# EAGLE board goJAMMAv02 (EAGLE 9.3.1), part 1 of 2
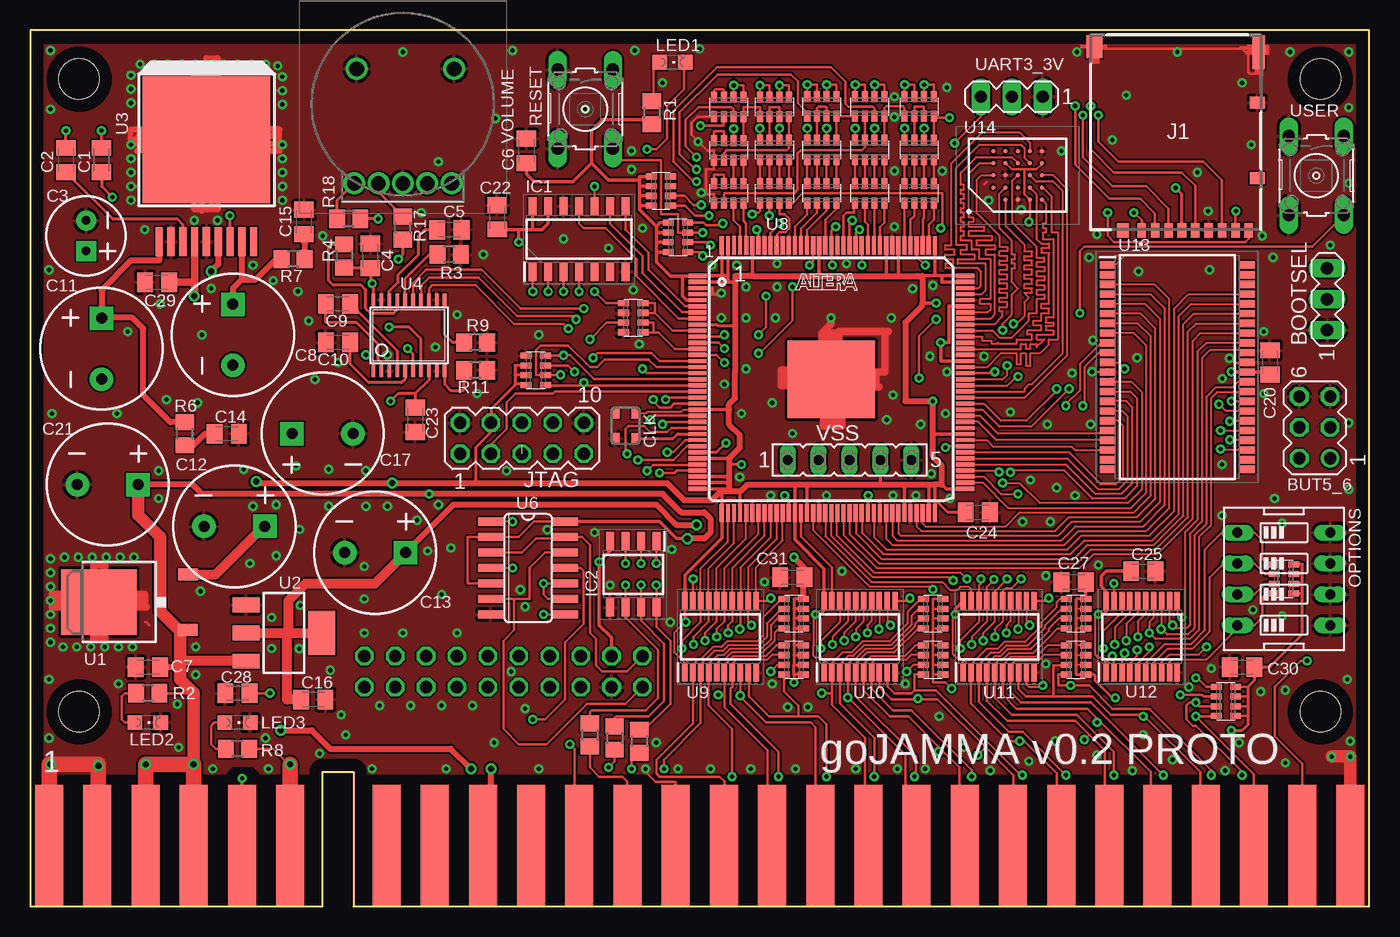
[diagram p2: board, top side]
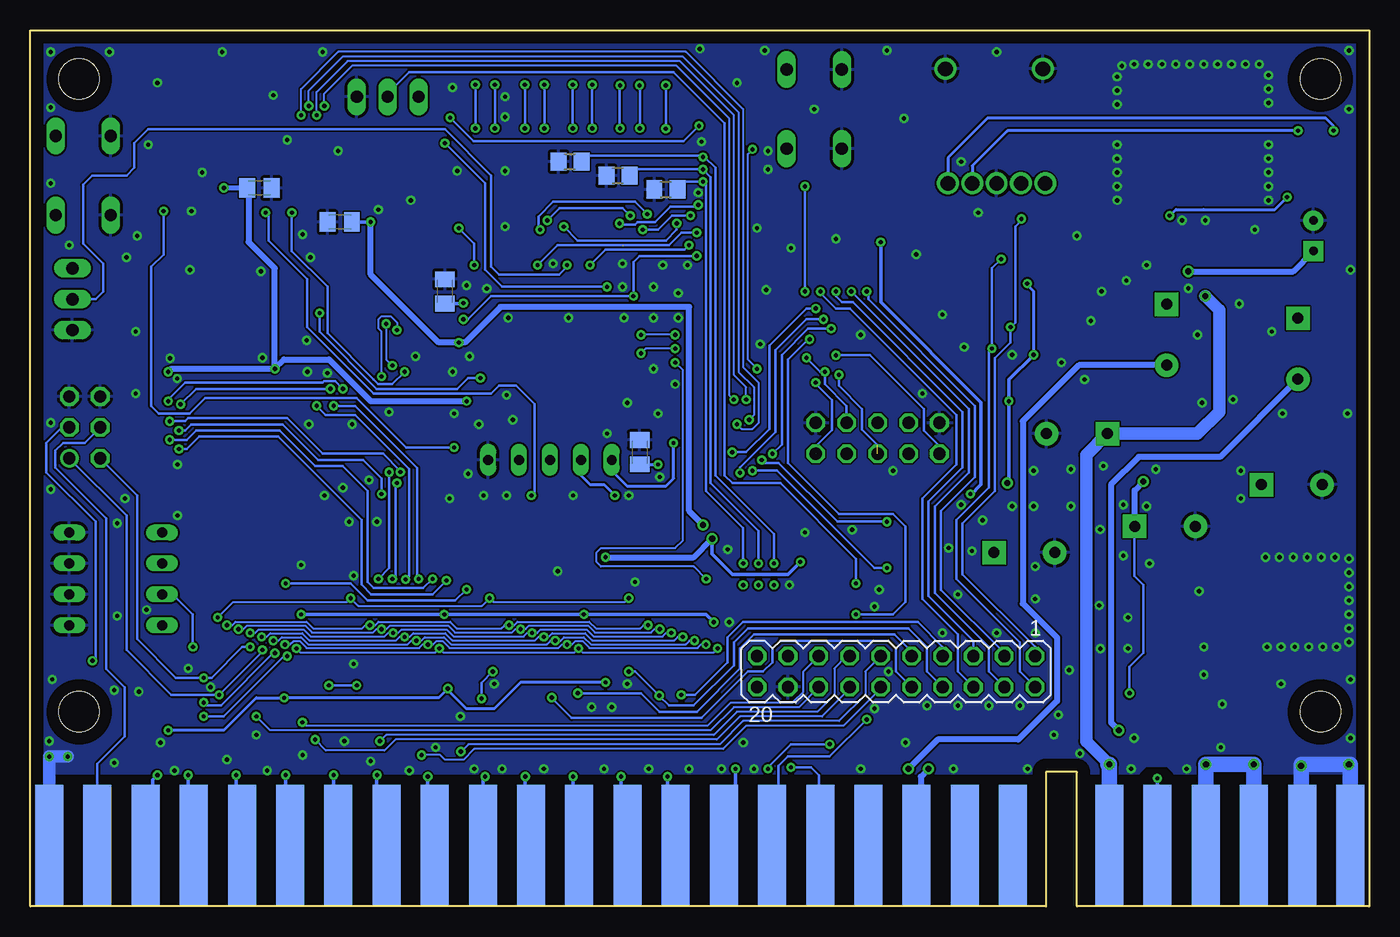
[diagram p3: board, bottom side, seen from below]

Size 110 x 72 mm. Coordinates in mm from the lower left corner, seen from the top.
Outline: 0,0 24,0 24,11.05 26.54,11.05 26.54,0 110,0 110,72 0,72 0,0
Copper layers (1*16): Top 0.035mm / dielectric 1.5mm / Bottom 0.035mm
Design rules "default *": minimum track width 6mil, minimum drill 0.35mm, track to track 6mil, track to pad 6mil, pad to pad 6mil, via to via 6mil, smd to smd 6mil, copper to edge 40mil, drill to drill 6mil, minimum pad ring 10mil, minimum via ring 8mil, stop-mask expansion 4mil, vias tented up to drill 20mil, thermal gap 10mil

## Footprints (pad centres in the part's own frame; a part is rotated, then mirrored left to right if it is on the bottom)
MA03-1 = drill 1.016 long: 1 -2.54,0; 2 0,0; 3 2.54,0
MA03-2 = drill 1.016: 1 -2.54,-1.27 | drill 1.016 octagon: 2 -2.54,1.27; 3 0,-1.27; 4 0,1.27; 5 2.54,-1.27; 6 2.54,1.27
C0805K = smd 1.3 x 1.6: 1 -1,0; 2 1,0
CPOL-RADIAL-2.5MM-6.5MM = drill 0.7 pad 1.651 square: 1 1.25,0 | drill 0.7 pad 1.651: 2 -1.25,0
CPOL-RADIAL-5MM-10MM = drill 0.9 pad 1.93 square: + 2.5,0 | drill 0.9 pad 1.93: - -2.5,0
ASE = smd 0.9 x 0.65: 1 -1.05,-0.825; 2 1.05,-0.825; 3 1.05,0.825; 4 -1.05,0.825
STAND-OFF = hole 3.302: 0,0
SOIC127P600X175-14N = smd 1.5 x 0.65: 1 -2.7,3.81; 2 -2.7,2.54; 3 -2.7,1.27; 4 -2.7,0; 5 -2.7,-1.27; 6 -2.7,-2.54; 7 -2.7,-3.81; 8 2.7,-3.81; 9 2.7,-2.54; 10 2.7,-1.27; 11 2.7,0; 12 2.7,1.27; 13 2.7,2.54; 14 2.7,3.81
SOIC127P600X175-8N = smd 1.525 x 0.65: 1 -2.712,1.905; 2 -2.712,0.635; 3 -2.712,-0.635; 4 -2.712,-1.905; 5 2.712,-1.905; 6 2.712,-0.635; 7 2.712,0.635; 8 2.712,1.905
DM3AT-SF-PEJM5_1 = smd 0.7 x 1.2: 1 -4.191,0.057; 2 -5.291,0.057; 3 -6.391,0.057; 4 -7.491,0.057; 5 -8.591,0.057; 6 -9.691,0.057; 7 -10.791,0.057; 8 -11.891,0.057; 10 -12.991,0.057 | smd 1.2 x 1: 9 -13.691,-10.443; 12 -13.691,-4.243 | smd 1 x 1.2: 11 -2.641,0.057 | smd 1 x 2.8: 13 -13.791,-14.593 | smd 1.3 x 1.9: 14 -0.291,-15.043
JAMMA_TOP = smd 2.3 x 10: 1 -53.46,0; 2 -49.5,0; 3 -45.54,0; 4 -41.58,0; 5 -37.62,0; 6 -33.66,0; 8 -25.74,0; 9 -21.78,0; 10 -17.82,0; 11 -13.86,0; 12 -9.9,0; 13 -5.94,0; 14 -1.98,0; 15 1.98,0; 16 5.94,0; 17 9.9,0; 18 13.86,0; 19 17.82,0; 20 21.78,0; 21 25.74,0; 22 29.7,0; 23 33.66,0; 24 37.62,0; 25 41.58,0; 26 45.54,0; 27 49.5,0; 28 53.46,0
JAMMA_BOTTOM = smd 2.3 x 10 bottom: _A 33.66,0; _B 37.62,0; _C 41.58,0; _D 45.54,0; _E 49.5,0; _F 53.46,0; A -53.46,0; B -49.5,0; C -45.54,0; D -41.58,0; E -37.62,0; F -33.66,0; J -25.74,0; K -21.78,0; L -17.82,0; M -13.86,0; N -9.9,0; P -5.94,0; R -1.98,0; S 1.98,0; T 5.94,0; U 9.9,0; V 13.86,0; W 17.82,0; X 21.78,0; Y 25.74,0; Z 29.7,0
MA05-2 = drill 1.016 octagon: 1 -5.08,-1.27; 2 -5.08,1.27; 3 -2.54,-1.27; 4 -2.54,1.27; 5 0,-1.27; 6 0,1.27; 7 2.54,-1.27; 8 2.54,1.27; 9 5.08,-1.27; 10 5.08,1.27
CHIPLED_0805 = smd 1.2 x 1.2: A 0,-1.05; C 0,1.05
EDG-04 = drill 0.813 long: 1 -3.81,-3.81; 2 -1.27,-3.81; 3 1.27,-3.81; 4 3.81,-3.81; 5 3.81,3.81; 6 1.27,3.81; 7 -1.27,3.81; 8 -3.81,3.81
R0805 = smd 1.3 x 1.5: 1 -0.95,0; 2 0.95,0
B3F-10XX = drill 1.016 long: 1 -3.251,2.261; 2 3.251,2.261; 3 -3.251,-2.261; 4 3.251,-2.261
CTS742C083 = smd 0.5 x 0.9: 1 -1.2,-0.8; 2 -0.4,-0.8; 3 0.4,-0.8; 4 1.2,-0.8; 5 1.2,0.8; 6 0.4,0.8; 7 -0.4,0.8; 8 -1.2,0.8
MA10-2 = drill 1.016 octagon: 1 -11.43,-1.27; 2 -11.43,1.27; 3 -8.89,-1.27; 4 -8.89,1.27; 5 -6.35,-1.27; 6 -6.35,1.27; 7 -3.81,-1.27; 8 -3.81,1.27; 9 -1.27,-1.27; 10 -1.27,1.27; 11 1.27,-1.27; 12 1.27,1.27; 13 3.81,-1.27; 14 3.81,1.27; 15 6.35,-1.27; 16 6.35,1.27; 17 8.89,-1.27; 18 8.89,1.27; 19 11.43,-1.27; 20 11.43,1.27
FE05-1 = drill 0.813 long: 1 -5.08,0; 2 -2.54,0; 3 0,0; 4 2.54,0; 5 5.08,0
TO-252 = smd 1 x 1.6: 1 -2.28,-4.8; 2 2.28,-4.8 | smd 5.4 x 6.2: 3 0,2.5
SOT223 = smd 1.219 x 2.235: 1 -2.311,-3.099; 2 0,-3.099; 3 2.311,-3.099 | smd 3.6 x 2.2: 4 0,3.099
DDPAK-9 = smd 0.6 x 2.4: 1 -3.89,0.03; 2 -2.92,0.03; 3 -1.95,0.03; 4 -0.98,0.03; 5 -0.01,0.03; 6 0.96,0.03; 7 1.93,0.03; 8 2.9,0.03; 9 3.87,0.03 | smd 10.48 x 10.42: 10 0,8.4
TSSOP20 = smd 0.305 x 0.991: 1 -2.925,-2.918; 2 -2.275,-2.918; 3 -1.625,-2.918; 4 -0.975,-2.918; 5 -0.325,-2.918; 6 0.325,-2.918; 7 0.975,-2.918; 8 1.625,-2.918; 9 2.275,-2.918; 10 2.925,-2.918; 11 2.925,2.918; 12 2.275,2.918; 13 1.625,2.918; 14 0.975,2.918; 15 0.325,2.918; 16 -0.325,2.918; 17 -0.975,2.918; 18 -1.625,2.918; 19 -2.275,2.918; 20 -2.925,2.918
SO14 = smd 0.66 x 2.032: 1 -3.81,-3.073; 2 -2.54,-3.073; 3 -1.27,-3.073; 4 0,-3.073; 5 1.27,-3.073; 6 2.54,-3.073; 7 3.81,-3.073; 8 3.81,3.073; 9 2.54,3.073; 10 1.27,3.073; 11 0,3.073; 12 -1.27,3.073; 13 -2.54,3.073; 14 -3.81,3.073
ALTERA_EQFP144 = smd 1.5 x 0.35: 1 -11,8.5; 2 -11,8; 3 -11,7.5; 4 -11,7; 5 -11,6.5; 6 -11,6; 7 -11,5.5; 8 -11,5; 9 -11,4.5; 10 -11,4; 11 -11,3.5; 12 -11,3; 13 -11,2.5; 14 -11,2; 15 -11,1.5; 16 -11,1; 17 -11,0.5; 18 -11,0; 19 -11,-0.5; 20 -11,-1; 21 -11,-1.5; 22 -11,-2; 23 -11,-2.5; 24 -11,-3; 25 -11,-3.5; 26 -11,-4; 27 -11,-4.5; 28 -11,-5; 29 -11,-5.5; 30 -11,-6; 31 -11,-6.5; 32 -11,-7; 33 -11,-7.5; 34 -11,-8; 35 -11,-8.5; 36 -11,-9; 73 11,-9; 74 11,-8.5; 75 11,-8; 76 11,-7.5; 77 11,-7; 78 11,-6.5; 79 11,-6; 80 11,-5.5; 81 11,-5; 82 11,-4.5; 83 11,-4; 84 11,-3.5; 85 11,-3; 86 11,-2.5; 87 11,-2; 88 11,-1.5; 89 11,-1; 90 11,-0.5; 91 11,0; 92 11,0.5; 93 11,1; 94 11,1.5; 95 11,2; 96 11,2.5; 97 11,3; 98 11,3.5; 99 11,4; 100 11,4.5; 101 11,5; 102 11,5.5; 103 11,6; 104 11,6.5; 105 11,7; 106 11,7.5; 107 11,8; 108 11,8.5 | smd 0.35 x 1.5: 37 -9,-11; 38 -8.5,-11; 39 -8,-11; 40 -7.5,-11; 41 -7,-11; 42 -6.5,-11; 43 -6,-11; 44 -5.5,-11; 45 -5,-11; 46 -4.5,-11; 47 -4,-11; 48 -3.5,-11; 49 -3,-11; 50 -2.5,-11; 51 -2,-11; 52 -1.5,-11; 53 -1,-11; 54 -0.5,-11; 55 0,-11; 56 0.5,-11; 57 1,-11; 58 1.5,-11; 59 2,-11; 60 2.5,-11; 61 3,-11; 62 3.5,-11; 63 4,-11; 64 4.5,-11; 65 5,-11; 66 5.5,-11; 67 6,-11; 68 6.5,-11; 69 7,-11; 70 7.5,-11; 71 8,-11; 72 8.5,-11; 109 8.5,11; 110 8,11; 111 7.5,11; 112 7,11; 113 6.5,11; 114 6,11; 115 5.5,11; 116 5,11; 117 4.5,11; 118 4,11; 119 3.5,11; 120 3,11; 121 2.5,11; 122 2,11; 123 1.5,11; 124 1,11; 125 0.5,11; 126 0,11; 127 -0.5,11; 128 -1,11; 129 -1.5,11; 130 -2,11; 131 -2.5,11; 132 -3,11; 133 -3.5,11; 134 -4,11; 135 -4.5,11; 136 -5,11; 137 -5.5,11; 138 -6,11; 139 -6.5,11; 140 -7,11; 141 -7.5,11; 142 -8,11; 143 -8.5,11; 144 -9,11 | smd 7.2 x 6.35: GND 0,0
SOP65P640X120-20N = smd 1.475 x 0.45: 1 -2.938,2.925; 2 -2.938,2.275; 3 -2.938,1.625; 4 -2.938,0.975; 5 -2.938,0.325; 6 -2.938,-0.325; 7 -2.938,-0.975; 8 -2.938,-1.625; 9 -2.938,-2.275; 10 -2.938,-2.925; 11 2.938,-2.925; 12 2.938,-2.275; 13 2.938,-1.625; 14 2.938,-0.975; 15 2.938,-0.325; 16 2.938,0.325; 17 2.938,0.975; 18 2.938,1.625; 19 2.938,2.275; 20 2.938,2.925
SOP80P1176X120-44N = smd 1.295 x 0.6: 1 -5.728,8.4; 2 -5.728,7.6; 3 -5.728,6.8; 4 -5.728,6; 5 -5.728,5.2; 6 -5.728,4.4; 7 -5.728,3.6; 8 -5.728,2.8; 9 -5.728,2; 10 -5.728,1.2; 11 -5.728,0.4; 12 -5.728,-0.4; 13 -5.728,-1.2; 14 -5.728,-2; 15 -5.728,-2.8; 16 -5.728,-3.6; 17 -5.728,-4.4; 18 -5.728,-5.2; 19 -5.728,-6; 20 -5.728,-6.8; 21 -5.728,-7.6; 22 -5.728,-8.4; 23 5.728,-8.4; 24 5.728,-7.6; 25 5.728,-6.8; 26 5.728,-6; 27 5.728,-5.2; 28 5.728,-4.4; 29 5.728,-3.6; 30 5.728,-2.8; 31 5.728,-2; 32 5.728,-1.2; 33 5.728,-0.4; 34 5.728,0.4; 35 5.728,1.2; 36 5.728,2; 37 5.728,2.8; 38 5.728,3.6; 39 5.728,4.4; 40 5.728,5.2; 41 5.728,6; 42 5.728,6.8; 43 5.728,7.6; 44 5.728,8.4
BGA24C100P5X5_600X800X120 = smd 0.37 x 0.37: A2 -1,2; A3 0,2; A4 1,2; A5 2,2; B1 -2,1; B2 -1,1; B3 0,1; B4 1,1; B5 2,1; C1 -2,0; C2 -1,0; C3 0,0; C4 1,0; C5 2,0; D1 -2,-1; D2 -1,-1; D3 0,-1; D4 1,-1; D5 2,-1; E1 -2,-2; E2 -1,-2; E3 0,-2; E4 1,-2; E5 2,-2
RK14J12A0A0K = drill 1.2 pad 1.8: 1 0,0; 2 2,0; 3 -2,0; 4 4,0; 5 -4,0 | drill 1.204 pad 1.806: MH1 -3.8,9.4; MH2 4.2,9.4

## Placement (x,y rotation side)
BOOTSEL  [MA03-1]  106.55,49.91 90 top
BUT5_6  [MA03-2]  105.54,39.37 90 top
C1  100nF  [C0805K]  5.84,61.34 270 top
C2  100nF  [C0805K]  2.92,61.34 270 top
C3  100uF  [CPOL-RADIAL-2.5MM-6.5MM]  4.57,55.12 270 top
C4  100nF  [C0805K]  27.94,53.47 90 top
C5  100nF  [C0805K]  34.42,55.63 0 top
C6  1uF  [C0805K]  40.77,62.1 90 top
C7  100nF  [C0805K]  9.65,19.68 180 top
C8  1000uF  [CPOL-RADIAL-5MM-10MM]  16.64,46.99 90 top
C9  2u2  [C0805K]  25.27,49.53 180 top
C10  2u2  [C0805K]  25.27,46.35 180 top
C11  1000uF  [CPOL-RADIAL-5MM-10MM]  5.84,45.85 90 top
C12  100uF  [CPOL-RADIAL-5MM-10MM]  16.76,31.24 0 top
C13  100uF  [CPOL-RADIAL-5MM-10MM]  28.32,29.08 0 top
C14  100nF  [C0805K]  16.13,38.86 0 top
C15  100nF  [C0805K]  22.48,56.26 90 top
C16  100nF  [C0805K]  23.24,17.02 0 top
C17  100uF  [CPOL-RADIAL-5MM-10MM]  24,38.86 180 top
C18  1uF  [C0805K]  59.94,37.34 90 bottom
C19  1uF  [C0805K]  75.95,50.55 90 bottom
C20  1uF  [C0805K]  101.85,44.7 90 top
C21  100uF  [CPOL-RADIAL-5MM-10MM]  6.35,34.67 0 top
C22  1uF  [C0805K]  38.35,56.64 90 top
C23  1uF  [C0805K]  31.62,40.01 270 top
C24  1uF  [C0805K]  77.85,32.38 0 top
C25  1uF  [C0805K]  91.44,27.56 0 top
C26  1uF  [C0805K]  91.19,59.05 0 bottom
C27  1uF  [C0805K]  85.72,26.67 180 top
C28  100n  [C0805K]  17.02,17.53 180 top
C29  1uF  [C0805K]  10.41,51.31 180 top
C30  1uF  [C0805K]  99.57,19.68 180 top
C31  1uF  [C0805K]  62.61,27.05 180 top
C33  1uF  [C0805K]  84.58,56.26 180 bottom
CLK  ASE  [ASE]  48.9,39.5 270 top
E$1  [STAND-OFF]  4,16 0 top
E$2  [STAND-OFF]  106,68 0 top
E$8  [STAND-OFF]  106,16 0 top
E$9  [STAND-OFF]  4,68 0 top
IC1  MCP3004-I_SL  [SOIC127P600X175-14N]  45.09,54.86 90 top
IC2  THS7314D  [SOIC127P600X175-8N]  49.53,27.3 270 top
J1  DM3AT-SF-PEJM5  [DM3AT-SF-PEJM5_1]  87.12,55.63 180 top
JAMMA1  JAMMA_TOP  [JAMMA_TOP]  55,5 0 top
JAMMA2  JAMMA_BOTTOM  [JAMMA_BOTTOM]  55,5 0 top
JTAG  [MA05-2]  40.39,38.48 0 top
LED1  [CHIPLED_0805]  52.76,69.39 270 top
LED2  [CHIPLED_0805]  9.65,15.11 270 top
LED3  [CHIPLED_0805]  17.02,15.11 270 top
OPTIONS  [EDG-04]  103,26.92 270 top
R1  1K  [R0805]  51.07,65.23 270 top
R2  150R  [R0805]  9.65,17.53 180 top
R3  1K  [R0805]  34.42,53.59 180 top
R4  1K  [R0805]  25.78,53.47 270 top
R5  0R  [R0805]  50.04,13.59 270 top
R6  2R7  [R0805]  12.7,38.86 90 top
R7  2R7  [R0805]  21.59,53.21 180 top
R8  560R  [R0805]  17.02,12.95 180 top
R9  1K  [R0805]  36.58,46.35 180 top
R11  1K  [R0805]  36.58,44.07 180 top
R12  0R  [R0805]  48.01,13.84 270 top
R13  0R  [R0805]  45.97,14.1 270 top
R14  3K3  [R0805]  65.66,61.21 0 bottom
R15  3K3  [R0805]  61.72,60.07 0 bottom
R16  3K3  [R0805]  57.78,58.93 0 bottom
R17  1M  [R0805]  30.61,55.75 90 top
R18  1M  [R0805]  26.16,56.52 180 top
RESET  [B3F-10XX]  45.59,65.53 270 top
RN1  CTS742C083  [CTS742C083]  73.03,62.18 180 top
RN2  CTS742C083  [CTS742C083]  73.03,58.62 180 top
RN3  CTS742C083  [CTS742C083]  68.96,62.18 180 top
RN4  CTS742C083  [CTS742C083]  68.96,58.62 180 top
RN5  CTS742C083  [CTS742C083]  73.03,65.73 180 top
RN6  CTS742C083  [CTS742C083]  68.96,65.73 180 top
RN7  CTS742C083  [CTS742C083]  65.03,62.18 180 top
RN8  CTS742C083  [CTS742C083]  65.03,58.62 180 top
RN9  CTS742C083  [CTS742C083]  61.14,62.18 180 top
RN10  CTS742C083  [CTS742C083]  61.14,58.62 180 top
RN11  CTS742C083  [CTS742C083]  65.03,65.73 180 top
RN12  CTS742C083  [CTS742C083]  57.38,62.15 180 top
RN13  CTS742C083  [CTS742C083]  57.38,58.62 180 top
RN14  CTS742C083  [CTS742C083]  61.14,65.71 180 top
RN15  CTS742C083  [CTS742C083]  57.38,65.71 180 top
RN16  CTS742C083  [CTS742C083]  53.21,54.99 270 top
RN17  CTS742C083  [CTS742C083]  41.53,44.07 90 top
RN18  CTS742C083  [CTS742C083]  85.92,20.26 90 top
RN19  CTS742C083  [CTS742C083]  85.92,24.07 90 top
RN20  CTS742C083  [CTS742C083]  49.53,48.39 270 top
RN21  CTS742C083  [CTS742C083]  74.17,20.26 90 top
RN22  CTS742C083  [CTS742C083]  74.17,24.07 90 top
RN23  CTS742C083  [CTS742C083]  62.74,20.26 90 top
RN24  CTS742C083  [CTS742C083]  51.82,58.8 90 top
RN26  CTS742C083  [CTS742C083]  62.74,24.07 90 top
RN27  CTS742C083  [CTS742C083]  103,26.92 90 top
RN28  CTS742C083  [CTS742C083]  98.23,16.86 90 top
SV2  [MA10-2]  38.86,19.3 180 bottom
SV3  [FE05-1]  67.31,36.7 0 top
U1  +3.3v REG  [TO-252]  8.13,25.02 90 top
U2  +1.8v REG  [SOT223]  20.83,22.48 270 top
U3  [DDPAK-9]  14.48,54.61 0 top
U4  PCM5101  [TSSOP20]  31.11,46.94 0 top
U6  74LS08D  [SO14]  40.89,27.81 270 top
U8  ALTERA_MAX10M25SCPAD  [ALTERA_EQFP144]  65.81,43.33 0 top
U9  SN74HC245PWR  [SOP65P640X120-20N]  56.71,22.16 90 top
U10  SN74HC245PWR  [SOP65P640X120-20N]  68.14,22.16 90 top
U11  SN74HC245PWR  [SOP65P640X120-20N]  79.57,22.16 90 top
U12  SN74HC245PWR  [SOP65P640X120-20N]  91.31,22.16 90 top
U13  IS61WV10248EDBLL-10TLI  [SOP80P1176X120-44N]  94.23,44.32 0 top
U14  IS66WVH16M8BLL-100B1LI  [BGA24C100P5X5_600X800X120]  81.12,60.1 90 top
UART3_3V  [MA03-1]  80.64,66.55 180 top
USER  [B3F-10XX]  105.66,60.07 270 top
VOLUME  RK14J12A0A0K  [RK14J12A0A0K]  30.61,59.44 0 top

## Tracks (layer width: path | path; a pad name or v marks a point on that pad's centre or on a via)
1BUT1  (via drill 0.35)
  Top 0.152: U11.2 77.29,19.89 78.61,21.21 79.52,21.21 80.08,21.77 81.78,21.77 83.07,23.06 83.07,23.35 84.33,24.61 84.33,25.02 84.58,25.27 RN19.5 | JAMMA1.22 84.33,5.37
  Top 0.203: U11.2 77.29,16.69 80.39,13.59 v81.28,13.59 81.66,13.59 84.33,10.92 84.33,5.37
  Bottom 0.152: SV2.13 42.93,20.57 43.94,19.56 43.94,17.4 45.34,16 51.94,16 53.85,14.1 80.77,14.1 v81.28,13.59
1BUT2  (via drill 0.35)
  Top 0.152: RN19.7 84.5,23.67 83.69,22.86 83.69,22.64 82.21,21.16 80.33,21.16 79.74,20.57 79.25,20.57 78.59,19.92 U11.4 | 88.28,5.38 JAMMA1.23
  Top 0.203: U11.4 78.59,16.91 80.26,15.24 85.85,15.24 87,14.1 | 88.28,5.38 88.28,12.81 87,14.1 | v86.61,13.72 87,14.1
  Top 0.305: 88.65,5.01 JAMMA1.23
  Bottom 0.152: SV2.14 42.67,17.91 44.96,15.62 51.69,15.62 53.59,13.72 80.01,13.72 80.9,12.83 85.72,12.83 v86.61,13.72
1BUT3  (via drill 0.35)
  Top 0.152: U11.6 79.89,19.86 80.58,20.55 82.66,20.55 83.57,21.46 RN18.5 | 92.08,6.31 92.62,5.76
  Top 0.203: 92.62,5.76 JAMMA1.24 | U11.6 79.89,17.39 81.03,16.26 86.87,16.26 87.64,15.48 | 87.64,15.48 92.08,11.05 92.08,6.31 | 87.64,15.48 v87.64,15.13
  Bottom 0.152: v87.64,15.13 87.38,14.86 54.36,14.86 52.45,16.76 47.37,16.76 46.48,17.65 46.48,19.3 SV2.15
1BUT4  (via drill 0.35)
  Top 0.152: 91.44,15.75 91.5,15.68 | RN18.7 85.07,19.81
  Top 0.203: 96.53,5.05 JAMMA1.25 | U11.8 81.19,17.87 81.79,17.27 84.07,17.27 | 84.07,17.27 87.25,17.27 88.77,15.75 91.44,15.75 | 96.14,5.44 96.14,11.05 91.5,15.68 v91.44,15.62 | 85.07,19.81 84.07,19.81 84.07,17.27
  Top 0.305: 96.14,5.44 96.53,5.05
  Bottom 0.152: SV2.16 46.86,16.38 52.2,16.38 54.1,14.48 90.3,14.48 v91.44,15.62
1BUT5  (via drill 0.35)
  Top 0.152: U12.2 89.03,19.23 89.03,20.45 v88.9,20.57 | 97.39,15.62 RN28.8 | v95.76,15.62
  Top 0.203: 100.48,5.05 JAMMA1.26 100.54,10.84 v95.76,15.62 | v95.76,15.62 97.39,15.62
  Bottom 0.203: v88.9,20.57 89.15,20.57 94.11,15.62 v95.76,15.62
1BUT6  (via drill 0.35)
  Top 0.152: U12.4 90.34,19.98 90.93,20.57 v90.93,21.08
  Top 0.203: RN28.6 96.4,17.26 96.27,17.4 v94.49,17.4
  Bottom 0.203: v90.93,21.08 90.93,20.95 v94.49,17.4 98.42,17.4 102.11,21.08 102.11,32.13 BUT5_6.1
1BUT6SEL  (via drill 0.35)
  Top 0.152: 104.78,5.28 JAMMA1.27
  Top 0.203: JAMMA1.27 104.5,11.72 102.24,13.97 102.24,18.04 104.39,20.19 v104.9,20.19
  Bottom 0.203: BUT5_6.3 107.44,39.37 108.7,38.11 108.7,35.68 104.65,31.62 104.65,20.45 v104.9,20.19
1DOWN  (via drill 0.35)
  Top 0.152: U10.4 67.16,19.92 67.5,20.26 67.7,20.26 68.62,21.17 70.84,21.17 72.69,23.02 72.69,23.21 73.14,23.67 RN22.7 | JAMMA1.19 71.88,5.94
  Top 0.203: U10.4 v67.16,17.17 71.88,12.45 71.88,5.94
  Bottom 0.152: 67.18,17.14 v67.16,17.17
  Bottom 0.203: SV2.10 38.86,19.3 38.86,21.21 39.5,21.84 48.39,21.84 49.02,21.21 49.02,20.07 49.78,19.3 51.05,19.3 54.86,15.49 65.53,15.49 67.18,17.14
1LEFT  (via drill 0.35)
  Top 0.152: RN21.5 72.71,21.46 71.82,20.56 69.08,20.56 68.45,19.94 U10.6 | 76.33,5.56 76.83,5.05
  Top 0.203: U10.6 68.46,17.77 70.61,15.62 72.14,15.62 74.83,12.93 | 74.83,12.93 76.33,11.43 76.33,5.56 | v74.62,12.72 74.83,12.93
  Top 0.305: 76.83,5.05 JAMMA1.20
  Bottom 0.152: SV2.11 41.4,19.3 41.4,17.4 43.56,15.24 51.44,15.24 53.34,13.34 74.02,13.34 v74.62,12.72
1RIGHT  (via drill 0.35)
  Top 0.152: RN21.7 72.56,19.86 v72.01,19.3 | 80.77,5.03 JAMMA1.21 | v72.94,17.08 72.94,17.02 | 78.42,13.02 78.42,13.14
  Top 0.203: U10.8 69.76,18 70.74,17.02 72.94,17.02 74.55,17.02 78.42,13.14 80.77,10.79 80.77,5.03 | v77.85,12.45 78.42,13.02
  Bottom 0.152: 72.9,17.08 v72.94,17.08 | SV2.12 40.13,17.91 43.18,14.86 51.18,14.86 53.09,12.95 73.53,12.95 74.42,12.06 75.95,12.06 76.33,12.45 v77.85,12.45
  Bottom 0.203: v72.01,19.3 72.94,18.38 v72.94,17.08
1UP  (via drill 0.35)
  Top 0.152: RN22.5 73.14,25.27 72.69,24.81 72.08,24.2 72.08,23.27 70.59,21.78 68.37,21.78 67.47,20.88 66.74,20.88 65.86,20 U10.2 | 68.58,5.28 JAMMA1.18
  Top 0.203: U10.2 65.86,17.53 | 65.86,17.53 65.86,16.56 68.58,13.84 68.58,5.28 | 65.86,17.53 v65.02,17.53
  Bottom 0.203: SV2.9 37.59,20.95 38.99,22.35 50.55,22.35 51.69,21.21 51.69,19.56 55.24,16 58.29,16 59.82,17.53 v65.02,17.53
2BUT1  (via drill 0.35)
  Top 0.152: RN19.6 85.05,24.4 84.67,24.4 83.38,23.1 83.38,22.88 81.96,21.46 80.2,21.46 79.63,20.89 78.93,20.89 77.94,19.9 U11.3
  Top 0.203: U11.3 77.94,16.8 80.39,14.35 81.53,14.35 v85.09,10.79
  Bottom 0.152: JAMMA2.Z 85.09,5.39
  Bottom 0.305: 84.96,5.26 JAMMA2.Z | v85.09,10.79 85.09,5.39
2BUT2  (via drill 0.35)
  Top 0.152: RN19.8 84.4,22.87 84.01,22.48 84.01,22.46 82.41,20.85 80.45,20.85 79.86,20.26 79.57,20.26 79.24,19.93 U11.5
  Top 0.203: U11.5 79.25,17.14 80.64,15.75 85.98,15.75 89.03,12.7 v89.03,10.79
  Bottom 0.305: JAMMA2._A 89.03,5.37 v89.03,10.79
2BUT3  (via drill 0.35)
  Top 0.152: RN18.6 83.27,20.66 82.86,20.24 80.92,20.24 80.54,19.86 U11.7 80.52,19.25
  Top 0.203: U11.7 80.54,17.63 81.41,16.76 87.12,16.76 v93.09,10.79
  Bottom 0.152: JAMMA2._B 93.09,5.47
  Bottom 0.305: v93.09,10.79 93.09,5.47
2BUT4  (via drill 0.35)
  Top 0.203: U11.9 81.84,18.23 82.04,18.03 83.06,18.03 v83.19,18.16 | v97.03,10.79 97.03,11.18 91.95,16.26 88.9,16.26 87,18.16 v85.47,18.16 84.45,18.16 84.45,19.06 RN18.8
  Bottom 0.152: JAMMA2._C 97.03,5.45
  Bottom 0.203: v85.47,18.16 v83.19,18.16
  Bottom 0.305: v97.03,10.79 97.03,5.45
2BUT5  (via drill 0.35)
  Top 0.152: v89.92,20.83 89.69,20.6 U12.3
  Top 0.203: RN28.7 96.06,16.46 v95.76,16.76 95.25,16.76 95,16.51 95,15.37 95.5,14.86 95.76,14.86 99.57,11.05 v99.57,10.79
  Bottom 0.152: 90.04,20.83 v89.92,20.83 | 99.95,5.59 JAMMA2._D
  Bottom 0.203: v95.76,16.76 95.52,16.53 94.34,16.53 90.04,20.83
  Bottom 0.305: v99.57,10.79 99.95,10.41 99.95,5.59
2BUT6  (via drill 0.35)
  Top 0.152: U12.5 90.99,20 91.95,20.95 v91.95,21.34
  Top 0.203: RN28.5 96.62,18.06 95.89,18.8 v95.76,18.8
  Bottom 0.203: v91.95,21.34 92.58,21.34 95.12,18.8 v95.76,18.8 98.04,18.8 101.22,21.97 101.22,33.78 BUT5_6.2
2BUT6SEL
  Bottom 0.203: JAMMA2._E 104.5,11.73 102.23,14 102.23,18.02 103.76,19.54 103.76,31.88 107.95,36.07 107.95,37.47 107.31,38.1 105.54,38.1 BUT5_6.4
2DOWN  (via drill 0.35)
  Top 0.152: RN22.8 72.97,22.87 70.97,20.87 68.75,20.87 67.81,19.93 U10.5 | 72.77,10.79 v72.64,10.67
  Top 0.203: U10.5 67.81,17.28 72.77,12.32 72.77,10.79
  Bottom 0.305: 73.15,5.33 JAMMA2.W 72.82,10.49 v72.64,10.67
2LEFT  (via drill 0.35)
  Top 0.152: RN21.6 72.35,20.66 71.94,20.26 69.41,20.26 69.11,19.96 U10.7 69.09,19.2
  Top 0.203: v77.34,10.67 77.34,11.18 72.39,16.13 70.87,16.13 69.09,17.91 69.09,19.2
  Bottom 0.152: v77.34,10.67 77.34,10.54 | JAMMA2.X 77.34,5.56
  Bottom 0.305: v77.34,10.67 77.34,5.56
2RIGHT  (via drill 0.35)
  Top 0.152: 72.65,19.06 72.64,19.05
  Top 0.203: U10.9 70.41,18.11 70.99,17.53 72.39,17.53 72.64,17.78 | 72.64,17.78 74.42,17.78 81.41,10.79 v81.51,10.79 | RN21.8 72.65,19.06 | 72.64,19.05 72.64,17.78
  Bottom 0.152: v81.51,10.79 81.53,10.79 | JAMMA2.Y 81.53,5.79
  Bottom 0.305: 81.03,5.29 JAMMA2.Y | 81.53,10.79 81.53,5.79
2UP  (via drill 0.35)
  Top 0.152: U10.3 66.51,19.9 67.18,20.57 67.59,20.57 68.49,21.48 70.72,21.48 72.39,23.14 72.39,23.87 72.9,24.38 73.28,24.38 RN22.6
  Top 0.203: U10.3 66.51,16.67 69.34,13.84 v69.34,10.67
  Bottom 0.152: JAMMA2.V 69.34,5.48
  Bottom 0.305: v69.34,10.67 69.34,5.48
5V  (via drill 0.35, 0.5)
  Top 0.152: RN21.3 74.97,20.57 | RN19.2 85.92,23.67 | RN19.3 85.92,24.47 | RN19.1 85.92,22.87 | 85.92,20.66 RN18.3 | RN18.4 85.92,21.46 | RN18.2 85.92,19.86 | v62.74,18.41 | 100.08,18.03 arc90 100.05,18.06 | 100.08,17.27 arc-90 100.07,17.26 | 100.08,16.38 arc90 100,16.46 | 104.52,24.77 104.52,25.72 104.52,26.54 104.52,27.32 104.52,28.12 | 103.8,26.54 RN27.2
  Top 0.203: 86.72,25.34 RN19.4 | RN18.3 86.72,20.57 | RN19.2 86.72,23.75 | RN22.1 74.17,22.87 | 74.17,21.46 RN21.4 | 74.17,22.87 74.17,21.46 | 74.17,21.46 74.17,20.66 | RN22.4 74.17,25.27 74.17,24.47 | 74.17,24.47 74.17,23.67 | 74.17,23.67 74.17,22.87 | RN22.3 74.17,24.47 | RN22.2 74.17,23.67 | RN21.3 74.17,20.66 | 74.17,19.06 RN21.1 | 74.17,20.66 74.17,19.86 | 74.17,19.86 74.17,19.06 | RN21.2 74.17,19.86 | U6.5 35.94,26.54 35.94,30.35 U6.2 40.13,30.35 41.4,31.62 U6.14 | R2.1 13.42,17.53 | v75.69,17.91 75.18,18.41 74.17,18.41 74.17,19.06 | 100.05,18.06 RN28.4 | 100.07,17.26 RN28.3 | 100,16.46 RN28.2 | 100.08,15.66 RN28.1 | 104.52,27.32 RN27.3 | 104.52,26.54 103.8,26.54 | RN27.1 104.52,25.72 | v13.4,11.68 13.42,11.68
  Top 0.254: RN19.4 85.92,25.27 85.92,24.47 85.92,23.67 85.92,22.87 85.92,21.46 85.92,20.66 85.92,19.86 85.92,19.06 RN18.1 87.37,19.06 87.5,18.92 87.5,18.54 88.9,17.14 v89.15,17.14 | RN26.1 62.74,22.87 | 62.74,20.66 RN23.3 | 62.74,22.87 62.74,21.46 | 62.74,21.46 62.74,20.66 | RN26.4 62.74,25.27 62.74,24.47 | 62.74,24.47 62.74,23.67 | 62.74,23.67 62.74,22.87 | RN26.3 62.74,24.47 | RN26.2 62.74,23.67 | 62.74,20.66 62.74,19.86 | 62.74,19.86 RN23.2 | 62.74,19.06 62.74,19.86 | RN23.4 62.74,21.46 | RN23.1 62.74,19.06 | 62.74,19.06 v62.74,18.41 | v98.68,14.48 99.57,14.48 100.08,14.99 100.08,15.66 100.08,16.38 100.08,17.27 100.08,18.03 | RN27.4 104.52,28.12 104.52,22.35 101.85,19.68 C30.1 100.57,18.58 100.05,18.06 | RN19.4 C27.1
  Top 0.305: v53.98,30.23 53.09,30.23 51.69,31.62 U6.14 | 63.54,27.9 63.54,27.12 C31.1 | SV2.17 47.75,22.1 46.74,23.11 v46.74,28.32 47.62,29.21 IC2.4 | C22.1 40.13,55.64 | 40.13,55.64 41.15,55.64 | 41.15,55.64 42.05,55.64 42.55,56.13 IC1.13 | IC1.14 41.27,55.77 41.15,55.64 | v40.13,54.61 40.13,55.64
  Top 0.508: C7.1 12.32,19.68 | C21.+ 8.87,34.65 8.89,34.67 13.34,34.67 14.1,33.91 v32.77,33.91 51.94,33.91 53.47,32.38 55.37,32.38 55.88,31.88 55.88,30.73 55.37,30.23 v53.98,30.23 | RN26.4 63.54,27.9 v62.74,28.7
  Top 0.813: U2.3 12.34,20.17 12.32,20.19
  Top 1.016: U1.1 12.32,22.74 12.32,22.61 | 12.32,22.61 10.67,24.26 10.67,30.35 8.85,32.17 C21.+ | 13.42,11.68 13.42,17.53 13.42,17.57 12.32,18.67 12.32,19.68 12.32,20.19 12.32,22.61
  Top 1.27: JAMMA2.C v9.46,11.68 13.42,11.68 JAMMA2.D
  Bottom 0.152: 75.69,17.78 v75.69,17.91
  Bottom 0.254: v62.74,18.41 69.73,18.41 71.88,16.26 74.17,16.26 75.69,17.78 | v75.69,17.91 76.45,17.14 v89.15,17.14 91.44,17.14 94.11,14.48 v98.68,14.48
  Bottom 0.305: v46.74,28.32 47.75,27.3 52.32,27.3 53.98,28.96 v53.98,30.23 | v40.13,54.61 40.13,49.69 31.88,41.43 31.88,34.67 32.77,33.78 v32.77,33.91
  Bottom 0.508: v62.74,28.7 55.5,28.7 v53.98,30.23
  Bottom 1.27: JAMMA2.C v9.46,11.68 13.42,11.68 JAMMA2.D
12V  (via drill 0.5)
  Top 0.152: v21.34,11.68 21.21,11.68
  Top 0.203: 21.21,11.68 19.94,12.95 R8.1
  Top 0.406: 13.37,51.31 13.5,51.44
  Top 0.508: 13.5,50.2 v13.46,50.16
  Top 0.61: U3.4 13.5,51.44 13.5,50.2 | C29.1 13.37,51.31
  Top 1.27: JAMMA2.F v21.34,11.68
  Bottom 1.016: v21.34,11.68 23.24,13.59 23.24,37.12 C17.+ 14.1,38.86 12.32,40.64 12.32,49.02 v13.46,50.16
  Bottom 1.27: JAMMA2.F v21.34,11.68 | 21.47,11.68 v21.34,11.68 | v21.34,11.68
-5V  (via drill 0.35)
  Top 0.254: JAMMA2.E 17.38,10.52 v17.4,10.54
  Bottom 0.254: 17.4,5.02 JAMMA2.E
  Bottom 0.305: v17.4,10.54 17.4,5.02
ADC_CLK
  Top 0.203: U8.8 53.27,48.33 49.78,51.82 49.78,53.21 47.24,55.75 45.47,55.75 45.09,56.13 IC1.11
ADC_CS
  Top 0.203: U8.6 53.79,49.33 50.8,52.32 50.8,53.72 48.9,55.63 IC1.8
ADC_DIN
  Top 0.203: U8.7 53.53,48.83 50.29,52.07 50.29,53.47 47.62,56.13 IC1.9
ADC_DOUT  (via drill 0.35)
  Top 0.203: RN20.1 47.31,49.59 v46.35,50.55 | v46.35,59.18 IC1.10
  Bottom 0.203: v46.35,50.55 v46.35,59.18
ADC_DOUT_R
  Top 0.203: RN20.8 51.31,49.59 51.31,48.79 | RN20.7 51.31,48.79 | 51.31,48.79 52.76,47.33 U8.10
AMP_INL  (via drill 0.35)
  Top 0.254: C1.2 5.84,59.18 v6.73,58.29 | U3.7 16.41,56.74 v16.38,56.77
  Bottom 0.254: v6.73,58.29 7.75,57.28 13.59,57.28 15.88,57.28 v16.38,56.77
AMP_INR
  Top 0.254: C2.2 6.75,56.52 12.06,56.52 12.53,56.05 U3.3
ANALOG1  (via drill 0.35)
  Top 0.203: v41.27,50.55 IC1.1
  Bottom 0.203: SV2.3 29.97,20.83 35.18,26.04 35.18,32.51 32.38,35.31 32.38,41.15 41.15,49.91 41.15,50.42 v41.27,50.55
ANALOG2  (via drill 0.35)
  Top 0.203: v42.55,50.55 IC1.2
  Bottom 0.203: SV2.4 31.24,19.3 31.24,21.34 35.69,25.78 35.69,32.89 32.89,35.69 32.89,40.89 v42.55,50.55
ANALOG3  (via drill 0.35)
  Top 0.203: v43.81,50.55 IC1.3
  Bottom 0.203: SV2.5 32.51,21.84 36.2,25.53 36.2,33.27 33.4,36.07 33.4,40.64 42.42,49.66 43.31,49.66 43.81,50.16 v43.81,50.55
ANALOG4  (via drill 0.35)
  Top 0.203: v45.09,50.55 IC1.4
  Bottom 0.203: SV2.6 33.78,19.3 33.78,22.35 36.7,25.27 36.7,33.53 33.91,36.32 33.91,40.39 42.67,49.15 43.81,49.15 45.09,50.42 v45.09,50.55
B0  (via drill 0.35)
  Top 0.203: RN10.8 62.65,57.82 63.45,58.62 74.93,58.62 74.93,55.88 v74.8,55.75 | v73.53,52.7 72.81,53.42 U8.112
  Bottom 0.203: v74.8,55.75 73.53,54.48 v73.53,52.7
B1  (1 unrouted)
  Top 0.203: 61.34,54.35 61.34,55.23 61.54,55.43 62.04,55.43 62.36,55.75 62.36,56.52 61.98,56.9 61.54,56.9 RN10.7
B2  (via drill 0.35)
  Top 0.152: 67.31,55.62 67.31,55.63 | 67.56,56.39 v67.53,56.39
  Top 0.203: U8.123 67.31,55.62 67.31,56.14 67.56,56.39 | v60.71,56.77 60.74,56.8 RN10.6
  Bottom 0.203: v67.53,56.39 66.51,57.4 61.34,57.4 v60.71,56.77
B3  (via drill 0.35)
  Top 0.152: 68.07,55.63 v68.13,55.63
  Top 0.203: U8.122 67.81,55.37 68.07,55.63 | v59.31,56.9 59.44,57.02 59.82,57.02 59.94,57.15 59.94,57.78 59.94,57.53 RN10.5
  Bottom 0.203: v68.13,55.63 68.26,55.75 68.26,56.71 67.06,57.91 60.33,57.91 v59.31,56.9
B4
  Top 0.203: U8.140 58.81,56.12 58.58,56.35 RN13.8
B5
  Top 0.203: U8.141 58.31,55.86 57.78,56.39 RN13.7
  Top 0.254: RN13.7
BOOTSEL  (via drill 0.35)
  Top 0.203: v65.91,52.7 65.81,52.8 U8.126 65.81,55.53 v66.17,55.88 | RN16.8 55.31,56.19 55.5,56.01 56.77,56.01 v56.9,56.13
  Bottom 0.203: v65.91,52.7 65.91,52.58 66.55,51.94 71.5,51.94 72.14,52.58 72.14,60.07 75.95,63.88 100.33,63.88 101.47,62.74 101.47,60.71 102.11,60.07 104.9,60.07 105.66,59.31 105.66,54.48 104.01,52.83 104.01,50.55 104.65,49.91 BOOTSEL.2 | v66.17,55.88 65.02,54.74 57.78,54.74 56.9,55.63 v56.9,56.13
BOUT  (via drill 0.35)
  Top 0.203: RN15.7 57.78,65.51 57.59,65.71 54.91,65.71 53.85,64.64 53.85,62.48 v54.74,61.59 | v48.9,28.19 IC2.3
  Bottom 0.203: v48.9,28.19 48.9,30.61 53.72,35.43 53.72,60.71 54.61,61.59 v54.74,61.59 54.86,61.72 64.2,61.72 R14.2
BOUT_AMP
  Top 0.203: 49.15,5.09 49.15,5.08 | 49.15,5.08 JAMMA1.13 | 49.15,5.08 49.02,5.21 49.02,10.29 48.64,10.67 46.74,10.67 45.97,11.43 R13.2
CARD_DETECT  (via drill 0.35)
  Top 0.203: U8.92 79.14,43.83 v79.25,43.94 | v88.52,57.02 88.52,55.12 89.03,54.61 99.82,54.61 100.11,54.9 J1.10
  Bottom 0.203: v79.25,43.94 80.26,42.93 81.41,42.93 81.78,43.3 85.6,47.12 85.6,50.93 88.52,53.85 v88.52,57.02
COIN1  (via drill 0.35)
  Top 0.152: RN23.5 61.28,21.46 60.39,20.56 57.73,20.56 57.11,19.94 57.02,19.94 57.02,19.23 U9.6 | JAMMA1.16 60.58,5.36
  Top 0.203: 60.88,5.05 JAMMA1.16 | U9.6 57.03,17.4 | 57.03,17.4 57.03,16.38 60.58,12.83 60.58,5.36 | v56.52,17.4 57.03,17.4
  Top 0.305: 61.09,5.15 JAMMA1.16
  Bottom 0.203: SV2.7 35.05,21.34 37.08,23.37 51.44,23.37 52.7,22.1 52.7,20.07 55.37,17.4 v56.52,17.4
COIN2  (via drill 0.35)
  Top 0.152: RN23.6 60.92,20.66 60.52,20.26 57.98,20.26 57.68,19.96 U9.7
  Top 0.203: U9.7 57.68,18.06 57.53,17.91 57.53,16.64 61.47,12.7 v61.47,10.67
  Bottom 0.305: JAMMA2.T 61.47,5.53 v61.47,10.67
CONF_DONE  (via drill 0.35)
  Top 0.152: U8.138
  Top 0.203: U8.138 59.81,55.5 v59.69,55.63 | RN24.1 53.78,57.6 54.61,56.77 v55.75,56.77
  Bottom 0.203: v59.69,55.63 58.42,55.63 57.28,56.77 v55.75,56.77
CSYNC_OUT  (via drill 0.35)
  Top 0.152: 43.94,27.79 U6.11
  Top 0.203: v41.27,15.37 42.29,15.37 43.94,17.02 43.94,21.72 45.47,23.24 45.47,27.56 45.21,27.81 U6.11
  Bottom 0.152: JAMMA2.P 48.51,5.55
  Bottom 0.203: 49.05,5.01 JAMMA2.P | v41.27,15.37 44.32,12.32 47.75,12.32 48.51,11.56 48.51,5.55
DAC_OUTL  (via drill 0.35)
  Top 0.254: U4.6 31.44,45.4 v30.99,45.85 | v30.23,53.21 30.61,53.59 R17.1
  Bottom 0.203: SV2.2 28.7,19.3 28.7,21.72 33.91,26.92 33.91,31.75 31.24,34.42 31.24,45.59 v30.99,45.85 30.99,52.45 v30.23,53.21
DAC_OUTL_RES
  Top 0.254: R17.2 28.61,58.7 VOLUME.3
DAC_OUTR  (via drill 0.35)
  Top 0.254: U4.7 32.09,46.65 31.11,47.62 v29.46,47.62 | v28.57,56.52 R18.1
  Bottom 0.203: SV2.1 27.43,21.34 33.4,27.3 33.4,31.5 30.73,34.16 30.73,45.09 29.46,46.35 v29.46,47.62 29.08,48.01 29.08,55.88 28.57,56.39 v28.57,56.52
DAC_OUTR_RES
  Top 0.254: R18.2 25.21,58.04 VOLUME.5
DAT1  (via drill 0.35)
  Top 0.203: U8.80 75.3,37.83 v75.18,37.72 | v99.06,57.15 99.01,57.1 J1.8
  Bottom 0.203: v75.18,37.72 79.12,37.72 83.19,41.78 95.63,41.78 96.9,40.51 99.44,40.51 100.08,41.15 100.08,52.58 99.06,53.59 v99.06,57.15
DAT2  (via drill 0.35)
  Top 0.203: U8.61 68.83,32.35 v68.83,33.78 | v90.68,57.02 91.31,56.39 J1.1
  Bottom 0.203: v68.83,33.78 68.58,34.04 68.58,41.27 70.1,42.8 71.5,42.8 72.14,42.16 81.79,42.16 87.25,47.62 87.25,51.56 90.42,54.74 90.42,56.77 v90.68,57.02
DIPSW0
  Top 0.152: U12.6 91.64,20.01 93.22,21.59 95.38,21.59 96.52,22.73 96.52,29.34 97.92,30.73 OPTIONS.1
  Top 0.203: RN27.5 101.67,28.12 101.22,28.57 101.22,30.1 100.58,30.73 OPTIONS.1
DIPSW1
  Top 0.152: U12.7 92.29,20.02 93.47,21.21 95.5,21.21 96.9,22.61 96.9,27.05 98.04,28.19 OPTIONS.2
  Top 0.203: RN27.6 101.45,27.32 100.58,28.19 OPTIONS.2
DIPSW2  (via drill 0.35)
  Top 0.152: U12.8 92.94,20.04 93.6,20.7 96.01,20.7 v96.65,21.34
  Top 0.203: RN27.7 101.45,26.52 100.58,25.65 OPTIONS.3
  Bottom 0.203: OPTIONS.3 98.3,25.65 96.65,24 v96.65,21.34
DIPSW3
  Top 0.152: U12.9 93.59,20.05 93.85,20.32 96.65,20.32 99.19,22.86
  Top 0.203: 99.19,22.86 OPTIONS.4 100.58,23.11 101.22,23.75 101.22,25.4 101.54,25.72 RN27.8
G0
  Top 0.203: 68.58,57.8 RN4.6 68.56,56.28 68.81,56.03 U8.120
G1
  Top 0.203: U8.124 66.81,56.78 67.06,57.02 67.69,57.02 67.69,57.66 67.73,57.7
  Top 0.305: RN4.5 67.73,57.79 67.73,57.7
G2
  Top 0.203: RN8.8 66.23,57.34 65.33,56.45 65.33,54.35
  Top 0.305: U8.127 65.33,54.35
G3
  Top 0.203: U8.130 63.81,55.57 65.43,57.18 RN8.7
G4
  Top 0.203: U8.131 63.31,55.72 64.63,57.03 RN8.6
G5
  Top 0.203: RN8.5 63.83,56.88 62.81,55.86 U8.132
GND  (via drill 0.35, 0.5)
  Top 0.152: 81.1,58.1 U14.C1 | 78.61,59.56 78.36,59.31 | U13.12 87.27,43.92 v87.25,43.94 | U13.34 99.92,44.68 98.91,44.68 v98.53,45.06 | 9.4,23.37 9.53,23.37 9.78,23.11 | 8.51,21.46 v8.38,21.34 | v8.26,59.18 8.89,59.18 | v20.7,67.06 20.07,67.06 | 1.78,23.88 v1.65,24
  Top 0.203: RN15.5 54.81,64.92 54.31,64.42 54.31,63.42 v54.86,62.87 55.63,62.1 56.18,62.1 RN12.5 56.18,60.58 55.5,60.58 55.5,58.67 | JAMMA1.14 53.02,10.24 51.38,10.24 50.62,11 50.62,11.3 v50.55,11.3 | 55.5,58.67 55.5,58.55 56.18,58.55 RN13.5 | v55.12,58.67 55.5,58.67 | 87.12,69.22 87.12,69.85 87.25,69.85 | 87.63,69.85 87.76,69.85 87.76,69.34 87.63,69.34 | 87.63,69.34 87.25,69.34 87.25,69.72 | 87.25,69.72 87.25,69.85 | 87.25,69.85 87.63,69.85 | 87.63,69.85 87.63,69.72 | 87.63,69.72 87.63,69.6 | 87.63,69.6 87.63,69.34 | 87.63,69.34 87.5,69.47 | 87.38,69.47 87.5,69.47 | 87.5,69.47 87.63,69.6 | 87.63,69.6 87.5,69.6 | 87.38,69.6 87.5,69.6 | 87.5,69.6 87.63,69.72 | 87.63,69.72 87.25,69.72 | 87.25,69.85 87.12,69.98 87.12,70.61 86.36,70.61 86.36,70.74 88.39,70.74 88.39,70.61 87.76,70.61 | 87.76,70.61 87.5,70.61 | 87.76,70.61 87.88,70.48 100.84,70.48 | 100.84,70.48 100.97,70.48 | 100.97,70.48 101.73,70.48 101.73,70.61 99.44,70.61 99.95,70.1 | 99.95,70.1 100.08,69.98 100.08,68.58 100.2,68.45 100.71,68.45 100.71,69.09 100.84,69.09 100.84,68.45 100.97,68.45 100.97,69.09 101.09,69.09 101.09,68.33 101.22,68.33 101.22,69.22 | 100.97,70.48 100.84,70.36 | 100.84,70.36 100.08,70.36 | 100.84,70.36 101.73,70.36 101.73,70.23 99.95,70.23 99.95,70.1 | 99.95,70.1 101.73,70.1 | 100.84,70.48 100.84,70.74 | 100.84,70.74 100.08,70.74 | 100.84,70.74 101.73,70.74
  Top 0.254: U8.4 56.01,50.33 | 56.01,50.33 56.68,50.33 v56.77,50.42 | U8.3 56.01,50.83 56.01,50.33
  Top 0.305: C4.2 28.3,54.47
  Top 0.508: v14.73,69.22 14.48,69.22 14.48,67.56 13.97,67.56 13.97,68.83 14.99,68.83 14.99,68.71 | 14.1,57.28 14.86,57.28 14.86,63.37 8.89,63.37 8.89,62.61 20.19,62.61 20.19,63.37 14.99,63.37 14.99,67.82 | 14.1,57.28 14.1,57.15 | 14.1,57.28 14.1,58.17 | 14.99,68.71 14.99,67.82 | U3.10 8.26,63.01 8.26,63.88 9.78,63.88 9.78,62.1 | 9.78,61.98 9.78,62.1 | 9.78,62.1 8.76,62.1 | 9.78,62.1 20.45,62.1 20.45,63.88 16.64,63.88 16.64,66.04 | U3.10 13.59,63.01 13.59,58.29 | 13.59,57.28 13.59,58.29 | 13.59,58.29 15.37,58.29 | 15.49,58.29 15.37,58.29 | 15.37,58.29 15.37,57.28 13.46,57.28 13.46,68.71 14.99,68.71 | U3.10 14.48,69.72 15.37,69.72 15.37,67.82 14.99,67.82
  Top 0.61: v65.79,48.39 65.79,47.88 65.02,47.12 65.02,46.1 65.15,45.97 65.53,46.35 65.53,47.12 66.17,47.12 66.04,46.99 66.04,46.1 66.29,46.1 66.42,45.97 66.42,47.24 70.48,47.24 70.23,46.99 70.23,43.94 69.09,43.94 69.09,42.67 69.47,42.67 | 69.72,42.67 69.47,42.67 | 69.47,42.67 69.47,43.56 65.15,43.56 | 62.61,43.56 62.61,44.07 61.72,44.07 61.72,42.8 62.36,42.8 62.36,43.18 61.98,43.18 61.98,43.56 62.61,43.56 | 62.61,43.56 65.15,43.56 | 66.17,40.39 65.53,40.39 65.53,39.5 65.15,39.5 65.15,43.56 | 66.17,40.39 66.17,40.51 | 66.17,40.39 66.17,39.88 66.04,39.88 66.04,39.5 66.67,39.5 66.67,40.51 | v1.65,25.15 9.4,25.15 | 9.4,25.15 9.4,25.02 | 9.4,25.15 9.4,25.65 1.78,25.65 1.78,24.64 6.1,24.64 | 9.53,24.64 6.1,24.64 | 6.1,24.64 6.1,28.07 5.21,28.07 5.21,21.97 6.1,21.97 6.1,25.02 U1.3
  Top 1.016: JAMMA2._F v108.46,12.32 v106.93,12.32
  Top 1.27: JAMMA2.A 1.54,11.68 v1.65,11.68 5.59,11.68 5.59,5.09 JAMMA2.B
  Bottom 1.016: JAMMA2._F v108.46,12.32 v106.93,12.32
  Bottom 1.27: JAMMA2.A 1.54,11.68 v1.65,11.68 5.59,11.68 5.59,5.09 JAMMA2.B
  other vias: 78.74,58.04 81.41,57.28 84.71,62.1 72.77,33.78 75.18,40.51 73.91,45.21 60.83,33.78 58.8,48.39 57.02,42.93 58.42,40.51 58.04,52.7 74.17,51.05 65.41,33.78 70.87,33.78 58.8,50.93 61.34,52.83 70.99,55.88 84.33,34.42 85.85,33.78 83.82,31.62 81.53,31.62 102.87,23.88 103.12,11.81 14.1,46.99 91.44,14.1 93.85,12.06 84.2,13.59 60.33,26.67 62.23,16.38 63.88,16.38 83.44,27.18 75.56,33.53 71.88,18.29 39.12,35.81 34.54,29.46 35.05,22.48 33.78,25.65 30.61,22.48 27.43,22.48 32.64,29.21 27.43,25.27 27.43,27.94 31.75,31.75 27.56,32.89 21.84,36.2 27.56,35.81 19.81,23.75 19.81,21.21 25.53,15.75 19.3,13.84 23.77,12.57 14.99,11.3 12.19,13.08 1.52,18.67 1.65,28.57 1.65,27.43 1.65,26.29 1.65,22.86 1.65,21.72 2.67,21.34 3.81,21.34 4.95,21.34 6.1,21.34 7.24,21.34 2.79,28.7 3.94,28.7 5.08,28.7 6.22,28.7 7.37,28.7 8.51,28.7 18.29,32.89 10.54,35.81 17.53,35.94 8.26,58.04 8.26,60.33 8.26,61.47 8.26,62.61 8.26,66.04 8.26,67.18 8.26,68.33 9.02,69.22 10.16,69.22 11.3,69.22 12.45,69.22 13.59,69.22 15.88,69.22 17.02,69.22 18.16,69.22 19.3,69.22 20.32,69.09 20.7,68.2 20.7,65.91 20.7,62.61 20.7,61.47 20.7,60.33 20.7,59.18 20.7,58.04 1.65,70.36 1.65,65.53 1.52,52.32 1.78,40.51 30.61,70.23 39.62,70.36 51.94,67.69 35.05,48.64 33.27,45.97 37.21,53.59 72.49,50.77 70.74,48.39 61.21,48.39 74.04,35.56 58.29,35.31 87.12,39.62 97.92,36.32 97.03,19.56 101.09,17.65 87.63,12.45 108.2,18.67 103.12,17.78 108.33,34.29 108.33,39.75 106.81,54.36 108.33,59.44 108.33,65.66 108.33,70.23 103.5,70.23 96.77,57.15 101.22,55.12 96.9,52.32 91.06,52.2 90.93,45.09 87.63,55.24 101.35,47.24 75.31,67.31 74.93,60.45 70.99,64.9 70.99,66.55 70.99,60.45 49.4,62.1 49.4,60.58 40.64,24.64 40.64,16.26 41.78,11.3 34.16,11.3 25.91,14.1 24.64,19.43 38.1,13.46 83.44,19.94 29.34,45.34 47.5,54.1 78.36,45.21 56.77,48.39 50.29,55.75 31.24,16.51 55.88,11.3 59.18,11.3 62.87,11.3 53.21,11.3 67.82,11.3 71.25,11.3 78.87,11.18 28.07,11.3 19.56,11.3 5.59,11.56 1.52,13.84 50.04,46.23 49.53,50.67 60.96,41.4 73.15,39.62 75.31,43.94 70.87,42.04 62.61,38.86 33.53,33.02 23.37,43.31 25.27,44.7 22.86,48.13 19.94,51.44 18.29,52.7 21.97,50.55 45.59,65.53 10.67,49.53 8,47.24 11.18,41.66 13.72,41.4 10.54,33.53 20.19,33.02 24.51,32.89 24.51,35.94 13.97,25.91 13.59,21.34 12.06,16.64 7.24,18.29 28.7,16.51 47.62,26.42 43.81,54.86 41.78,46.99 36.7,42.16 33.53,61.21 99.57,67.69 100.33,62.61 87.76,28.07 33.78,16.51 61.34,50.93 56.01,52.7 58.8,44.2 88.9,62.99 70.36,40.01 97.92,32.13 101.35,42.16 18.03,28.19 38.23,64.77 49.66,70.36 54.99,70.48 99.31,13.46 60.96,18.29 22.07,21.18 7.11,40.51 14.86,50.8 9.4,55.63 15.37,56.39 13.46,56.39 73.53,11.3 90.55,11.18 98.17,11.18 95.2,18.03 66.67,27.56 87,53.34 108.46,13.59 74.68,15.62 82.17,35.05 80.52,40.64 83.57,39.62 76.71,13.08 52.58,23.37 52.7,29.34 46.35,30.73 42.47,30.96 40.26,26.04 20.19,28.83 22.1,30.99 22.17,24.74 85.98,70.23 67.06,52.83 51.44,13.46 13.59,19.05 36.32,16.51 39.5,19.3 95.89,60.33 90.04,66.67 94.23,70.23 87.3,46.53 102.23,33.53 102.87,31.5 82.04,11.94 29.34,32.89 24,55.12 32.13,57.02 85.6,43.84 97.94,43.38 102.11,53.34 100.46,24.38
  pour Bottom: 0.38,71.63 109.6,71.63 109.6,10.92 18.92,10.92 18.29,11.56 16.64,11.56 16,10.92 0.38,10.92
  pour Top: 0.38,71.12 109.6,71.12 109.6,10.92 18.92,10.92 18.29,11.56 16.64,11.56 16,10.92 0.38,10.92
  cutout Top: 54.1,50.29 54.1,50.8 55.75,50.8 55.75,50.29
GOUT  (via drill 0.35)
  Top 0.203: RN11.5 63.83,65.28 63.07,66.04 63.07,67.81 62.51,68.38 56.44,68.38 53.34,65.27 53.34,61.85 54.61,60.58 v54.74,60.58 | v50.16,28.19 IC2.2
  Bottom 0.203: v50.16,28.19 50.16,30.86 54.1,34.8 54.1,59.94 v54.74,60.58 60.2,60.58 60.71,60.07 R15.2
GOUT_AMP  (via drill 0.35)
  Top 0.203: R12.2 48.01,11.94 v47.5,11.43
  Bottom 0.203: v47.5,11.43 45.85,11.43 45.21,10.79 45.21,5.11 JAMMA2.N
HRCLKN  (via drill 0.35)
  Top 0.152: U14.B1 80.12,55.94 81.66,54.4 81.66,53.85 82.3,53.85 82.3,53.47 81.66,53.47 81.66,53.09 82.3,53.09 82.3,52.7 81.66,52.7 81.66,52.32 82.3,52.32 82.3,51.94 81.66,51.94 81.66,51.56 82.3,51.56 82.3,51.18 81.66,51.18 81.66,50.8 82.3,50.8 82.3,50.42 81.66,50.42 82.04,50.04 81.66,49.66 81.66,48.51 81.03,47.88 v80.77,47.88 | U8.91 79.91,43.33 80.26,43.69 v80.26,44.45
  Bottom 0.152: v80.77,47.88 80.77,44.96 v80.26,44.45
HRCLKP  (via drill 0.35)
  Top 0.152: U14.B2 79.63,58.6 79.63,55.75 80.64,54.74 80.64,53.59 80.9,53.59 80.9,53.21 80.64,53.21 80.64,52.83 80.9,52.83 80.9,52.45 80.64,52.45 80.64,51.31 81.15,50.8 80.64,50.29 80.64,48.64 79.88,47.88 v79.88,47.37 | U8.90 80.3,42.83 81.03,43.56 v81.15,43.56
  Bottom 0.152: v81.15,43.56 81.15,47.24 81.41,47.5 81.41,48.26 81.15,48.51 80.39,48.51 79.88,48.01 v79.88,47.37
HRCS
  Top 0.152: U14.A3 79.1,60.07 78.11,60.07 77.72,59.69 77.72,57.02 79.63,55.12 79.63,54.23 80.26,54.23 80.26,53.85 79.63,53.85 79.63,53.47 80.26,53.47 80.26,53.09 79.63,53.09 79.63,52.7 80.26,52.7 80.26,52.32 79.63,52.32 79.63,51.94 80.26,51.94 80.26,51.56 79.63,51.56 79.63,51.18 80.26,51.18 80.26,50.8 79.63,50.8 79.63,50.42 80.26,50.42 80.26,50.04 79.63,50.04 79.63,49.66 80.26,49.66 80.26,49.28 79.63,49.28 79.63,48.9 79.88,48.9 79.88,48.51 79.2,47.83 U8.100
HRDQ0
  Top 0.152: U14.D3 82.66,59.56 84.07,59.56 84.84,58.8 84.84,45.47 82.3,42.93 82.04,42.93 81.7,42.59 81.7,42.33 U8.89
HRDQ1
  Top 0.152: U14.D2 82.68,58.54 82.68,54.86 83.06,54.48 83.69,54.48 83.69,54.1 83.06,54.1 83.06,53.72 83.69,53.72 83.69,49.53 83.06,49.53 83.06,49.15 83.69,49.15 83.69,48.77 83.06,48.77 83.06,48.13 82.42,48.13 82.42,47.75 83.06,47.75 83.06,47.37 81.92,47.37 81.92,46.99 82.3,46.99 82.3,46.61 81.03,46.61 81.03,46.23 79.63,46.23 79.52,46.34 79.4,46.23 78.99,46.23 78.99,46.48 78.23,46.48 78.23,46.83 U8.98
HRDQ2
  Top 0.152: U8.102 78.68,48.83 78.87,49.02 78.87,49.53 78,49.53 78,49.91 78.87,49.91 78.87,53.21 77.98,53.21 77.98,53.98 77.34,53.98 77.34,54.74 76.45,54.74 76.45,55.12 76.71,55.12 76.71,55.5 76.45,55.5 76.45,55.88 76.71,55.88 76.71,56.26 76.45,56.26 76.45,56.64 76.71,56.64 76.71,57.02 76.45,57.02 76.45,57.4 76.71,57.4 76.71,57.78 76.45,57.78 76.45,58.17 76.71,58.17 76.71,58.55 76.45,58.55 76.45,58.93 76.71,58.93 76.71,59.31 76.45,59.31 76.45,60.33 77.72,61.59 80.64,61.59 81.12,61.12 U14.C4
HRDQ3
  Top 0.152: U8.105 78.19,50.33 78.49,50.62 78.49,52.83 76.2,52.83 76.2,53.21 77.6,53.21 77.6,53.59 76.45,53.59 76.45,53.98 76.96,53.98 76.96,54.36 76.07,54.36 76.07,60.71 77.98,62.61 81.41,62.61 81.66,62.36 81.66,61.56 U14.D4
HRDQ4
  Top 0.152: U8.106 77.91,50.83 78.11,51.03 78.11,52.2 77.85,52.45 75.18,52.45 75.18,52.83 75.82,52.83 75.82,53.21 75.18,53.21 75.18,53.59 75.95,53.59 75.95,53.98 75.18,53.98 75.18,54.36 75.69,54.36 75.69,61.09 78.23,63.63 81.28,63.63 82.12,62.78 U14.D5
HRDQ5
  Top 0.152: U14.E3 84.05,60.1 85.22,58.93 85.22,45.34 81.71,41.83 U8.88
HRDQ6
  Top 0.152: U14.E2 83.19,59.1 83.95,58.33 83.95,55.37 84.45,55.37 84.45,46.61 83.69,46.61 83.69,46.18 82.98,45.47 82.17,45.47 82.17,44.45 81.79,44.45 81.79,45.47 81.41,45.47 81.41,44.58 81.03,44.58 81.03,45.47 79.76,45.47 78.62,44.33 U8.93
HRDQ7
  Top 0.152: 83.19,58.03 U14.E1 83.44,57.78 83.44,56.13 83.19,56.13 83.19,55.75 83.44,55.75 83.44,55.37 83.19,55.37 83.19,54.86 84.07,54.86 84.07,48.39 83.44,48.39 83.44,48.01 84.07,48.01 84.07,47.7 83.44,47.7 83.44,47.37 84.07,47.37 84.07,46.99 82.68,46.99 82.68,46.61 83.31,46.61 82.68,45.97 82.68,46.23 82.17,46.23 82.17,45.85 81.79,45.85 81.79,46.23 81.41,46.23 81.41,45.83 U8.96
HRRESET
  Top 0.152: U8.101 78.91,48.33 79.25,48.67 79.25,53.59 78.49,53.59 78.49,53.98 79.25,53.98 79.25,54.36 77.72,54.36 77.72,54.74 78.99,54.74 78.99,55.12 77.09,55.12 77.09,55.5 78.36,55.5 78.36,55.88 77.09,55.88 77.09,56.26 77.47,56.26 77.47,56.64 77.09,56.64 77.09,60.2 77.98,61.1 U14.A4
HRRWDS
  Top 0.152: U14.C3 80.64,59.62 80.64,56.26 82.68,54.23 82.68,53.34 83.31,53.34 83.31,52.96 82.68,52.96 82.68,52.58 83.31,52.58 83.31,52.2 82.68,52.2 82.68,51.82 83.31,51.82 83.31,51.44 82.68,51.44 82.68,51.05 83.31,51.05 83.31,50.67 82.68,50.67 82.68,50.29 83.31,50.29 83.31,49.91 82.68,49.91 82.68,48.77 82.04,48.77 82.04,48.13 80.64,46.74 79.63,46.74 79.03,47.33 U8.99
HSYNC  (via drill 0.35)
  Top 0.152: v39.62,31.62 U6.1
  Top 0.203: 54.8,37.85 U8.29 53.96,37.83 52.83,36.7 v49.91,36.7
  Bottom 0.203: v49.91,36.7 49.66,36.45 48.51,36.45 43.69,31.62 v39.62,31.62
HSYNC5
  Top 0.152: U6.13 43.99,30.37
  Top 0.203: U6.3 40.39,29.08 41.53,30.23 43.84,30.23 U6.13 | 43.99,30.37 45.32,30.37 45.97,29.72 45.97,22.48 46.48,21.97 46.48,19.81 46.99,19.3 49.02,19.3 SV2.19
I2S_DCLK  (via drill 0.35)
  Top 0.203: v49.02,37.21 48.9,37.34 48.9,39.24 49.15,39.5 50.42,39.5 50.93,38.99 52.32,38.99 52.67,39.33 U8.26 | U4.13 32.74,50.77 33.02,51.05 36.58,51.05 39.75,47.88 43.81,47.88 v44.2,47.5
  Bottom 0.203: v44.2,47.5 46.1,47.5 48.26,45.34 48.26,37.97 v49.02,37.21
I2S_DIN  (via drill 0.35)
  Top 0.203: v51.69,35.64 52.91,35.64 53.1,35.83 U8.33 | U4.14 32.09,51.01 32.77,51.69 36.83,51.69 40.01,48.51 44.58,48.51 v44.83,48.26
  Bottom 0.203: v44.83,48.26 46.23,48.26 48.77,45.72 48.77,38.99 51.69,36.07 v51.69,35.64
I2S_LRCK  (via drill 0.35)
  Top 0.203: U4.15 31.44,51.25 32.51,52.32 37.08,52.32 40.26,49.15 v45.47,49.15 | U8.28 53.83,38.33 52.83,37.34 v52.32,37.34
  Bottom 0.203: v45.47,49.15 46.23,49.15 49.28,46.1 49.28,39.24 51.18,37.34 v52.32,37.34
JBUS0  (via drill 0.35)
  Top 0.152: v76.39,21.21 76.39,21.84 77.94,23.39 U11.18 77.94,26.38 78.11,26.54 v78.11,26.92 | U10.18 66.51,23.39 64.96,21.84 v64.96,21.21 | U9.18 55.08,27.78 57.28,29.97 57.28,32.29 U8.38 | U13.9 87.98,46.32 86.23,44.58 86.23,42.42 85.09,41.27 v85.09,41.15 | U12.18 89.69,24.16 88.14,22.61 v88.14,21.21
  Top 0.203: U9.18 55.08,23.39 53.53,21.84 v53.53,21.21 | U10.18 66.55,25.14
  Bottom 0.152: v88.14,21.21 87.82,20.89 76.71,20.89 v76.39,21.21 76.07,20.89 65.28,20.89 v64.96,21.21 64.64,20.89 53.85,20.89 v53.53,21.21
  Bottom 0.203: v85.09,41.15 83.31,41.15 78.21,36.04 78.21,26.92 v78.11,26.92
JBUS1  (via drill 0.35)
  Top 0.152: v77.34,21.53 77.34,22.16 78.59,23.41 U11.17 78.59,26.27 79.2,26.88 | U10.17 67.16,23.41 65.91,22.16 v65.91,21.53 | U9.17 55.73,27.79 57.81,29.88 U8.39 | 79.2,26.88 79.25,26.92 | U13.10 87.81,45.52 86.61,44.32 86.61,41.27 v86.49,41.15 | v79.17,26.88 79.2,26.88 | U12.17 90.34,24.17 89.09,22.92 v89.09,21.53
  Top 0.203: U9.17 55.73,23.41 54.48,22.16 v54.48,21.53 | U10.17 67.18,25.12
  Bottom 0.152: v89.09,21.53 88.68,21.53 88.39,21.82 87.89,21.82 87.31,21.24 78.04,21.24 77.75,21.53 v77.34,21.53 76.93,21.53 76.64,21.82 76.14,21.82 75.56,21.24 66.61,21.24 66.33,21.53 v65.91,21.53 65.5,21.53 65.21,21.82 64.65,21.82 64.07,21.24 55.18,21.24 54.9,21.53 v54.48,21.53
  Bottom 0.203: v86.49,41.15 85.72,40.39 83.31,40.39 78.87,35.94 78.87,27.18 v79.17,26.88
JBUS2  (via drill 0.35)
  Top 0.152: v78.3,21.84 78.3,22.48 79.24,23.42 U11.16 79.25,25.91 v80.26,26.92 | U10.16 67.81,23.42 66.86,22.48 v66.86,21.84 | U9.16 56.39,27.81 58.81,30.24 U8.41 | U13.13 90.48,43.12 91.31,42.29 91.31,34.29 90.17,33.15 82.93,33.15 81.28,34.8 v79.88,34.8 | U12.16 90.99,24.19 90.04,23.24 v90.04,21.84
  Top 0.203: U9.16 56.38,23.42 55.44,22.48 v55.44,21.84 | U10.16
  Bottom 0.152: v90.04,21.84 89.63,21.84 89.34,22.13 87.77,22.13 87.19,21.55 79,21.55 78.71,21.84 v78.3,21.84 77.88,21.84 77.59,22.13 76.03,22.13 75.45,21.55 67.57,21.55 67.28,21.84 v66.86,21.84 66.45,21.84 66.16,22.13 64.53,22.13 63.95,21.55 56.14,21.55 55.85,21.84 v55.44,21.84
  Bottom 0.203: v79.88,34.8 80.01,34.67 80.01,27.18 v80.26,26.92
JBUS3  (via drill 0.35)
  Top 0.152: v79.25,22.16 79.25,22.8 79.89,23.44 U11.15 79.89,25.92 80.14,26.16 80.64,26.16 v81.41,26.92 | U10.15 68.45,23.43 67.82,22.8 v67.82,22.16 | v91,22.16 90.99,22.15 90.99,23.42 91.64,24.07 U12.15 | U9.15 57.03,27.82 59.82,30.61 U8.43 | U13.14 90.39,42.32 90.93,41.78 90.93,34.54 89.92,33.53 87.25,33.53 84.96,35.81 80.64,35.81 v80.52,35.69
  Top 0.203: U10.15 | U9.15 57.02,23.43 56.39,22.8 v56.39,22.16
  Bottom 0.152: v91,22.16 90.58,22.16 90.29,22.45 87.66,22.45 87.08,21.87 79.95,21.87 79.66,22.16 v79.25,22.16 78.84,22.16 78.55,22.45 75.91,22.45 75.33,21.87 68.52,21.87 68.23,22.16 v67.82,22.16 67.41,22.16 67.12,22.45 64.42,22.45 63.84,21.87 57.09,21.87 56.8,22.16 v56.39,22.16
  Bottom 0.203: v81.41,26.92 80.52,27.81 v80.52,35.69
JBUS4  (via drill 0.35)
  Top 0.152: U11.14 80.54,23.45 80.2,23.11 v80.2,22.48 | U10.14 69.11,23.45 68.77,23.11 v68.77,22.48 | U9.14 57.68,27.84 60.33,30.48 60.33,32.32 U8.44 | U13.31 99.93,42.29 97.54,42.29 97.03,41.78 97.03,31.37 96.01,30.35 96.01,22.73 95.25,21.97 92.46,21.97 v91.95,22.48 91.95,23.37 92.29,23.71 U12.14
  Top 0.203: U9.14 57.68,23.45 57.34,23.11 v57.34,22.48 | 69.09,25.12 U10.14
  Bottom 0.152: v91.95,22.48 91.54,22.48 91.25,22.77 87.55,22.77 86.97,22.19 80.9,22.19 80.61,22.48 v80.2,22.48 79.79,22.48 79.5,22.77 75.8,22.77 75.22,22.19 69.47,22.19 69.18,22.48 v68.77,22.48 68.36,22.48 68.07,22.77 64.31,22.77 63.73,22.19 58.04,22.19 57.75,22.48 v57.34,22.48
JBUS5  (via drill 0.35)
  Top 0.152: U11.13 81.19,22.83 | U10.13 69.76,22.83 v69.72,22.8 | U9.13 58.33,27.85 60.81,30.33 U8.45 | U12.13 92.94,22.83 | 92.94,22.83 v92.9,22.8 | 92.94,22.83 93.42,22.35 95.12,22.35 95.63,22.86 95.63,30.48 96.65,31.5 96.65,41.91 97.41,42.67 98.81,42.67 99.26,43.12 U13.32
  Top 0.203: 81.19,22.83 v81.15,22.8 | U9.13 58.33,22.83 v58.29,22.8 | 69.72,25.14 U10.13
  Bottom 0.152: v92.9,22.8 92.49,22.8 92.2,23.09 87.43,23.09 86.85,22.51 81.85,22.51 81.56,22.8 v81.15,22.8 80.74,22.8 80.45,23.09 75.69,23.09 75.11,22.51 70.42,22.51 70.14,22.8 v69.72,22.8 69.31,22.8 69.02,23.09 64.19,23.09 63.61,22.51 58.99,22.51 58.7,22.8 v58.29,22.8
JBUS6  (via drill 0.35)
  Top 0.152: U11.12 81.84,23.38 v82.11,23.11 | U10.12 70.41,23.38 v70.67,23.11 | U9.12 58.98,27.87 61.31,30.2 U8.46 | U13.35 99.77,45.72 96.9,45.72 96.27,45.09 96.27,31.62 95.25,30.61 95.25,23.11 95,22.86 94.11,22.86 v93.85,23.11 93.59,23.38 U12.12
  Top 0.203: U9.12 58.98,23.38 v59.24,23.11
  Bottom 0.152: v93.85,23.11 93.44,23.11 93.15,23.4 87.32,23.4 86.78,22.86 82.74,22.86 82.49,23.11 v82.11,23.11 81.69,23.11 81.4,23.4 75.51,23.4 74.97,22.86 71.31,22.86 71.06,23.11 v70.67,23.11 70.26,23.11 69.97,23.4 64.08,23.4 63.53,22.86 59.88,22.86 59.63,23.11 v59.24,23.11
JBUS7  (via drill 0.35)
  Top 0.152: U8.47 61.81,30.06 59.63,27.88 U9.11 | U13.36 96.61,46.32 95.89,45.59 95.89,31.75 94.87,30.74 94.87,28.71 94.87,28.7 94.87,23.99 94.62,23.74 94.61,23.75 | 94.24,24.89 94.24,24 94.5,23.74 94.61,23.74 94.61,23.75 | 94.61,23.75 v94.62,23.76
  Top 0.203: v83.69,25.34 83.46,25.1 U11.11 | v72.26,25.34 72.03,25.1 U10.11 | v60.83,25.34 60.6,25.1 U9.11 | U12.11 94.24,24.89 94.24,24.63
  Bottom 0.152: v60.83,25.34 61.15,25.02 71.94,25.02 v72.26,25.34 72.9,24.7 83.06,24.7 v83.69,25.34 84.01,25.02 93.36,25.02 v94.62,23.76
JOE0  (via drill 0.35)
  Top 0.152: 54.43,26.87 54.48,26.92
  Top 0.203: U9.19 54.43,26.87 | 54.48,26.92 v54.47,26.92 | v57.02,44.7 56.4,45.33 U8.14
  Bottom 0.152: v54.47,26.92 55.49,27.94 63.12,27.94 63.5,28.32 63.5,29.08 63.12,29.46 57.02,29.46 56.39,30.1 56.39,44.07 v57.02,44.7
JOE1
  Top 0.203: U8.50 63.31,30.41 65.86,27.87 U10.19
JOE2
  Top 0.152: U8.54 65.31,30.44 69.09,26.67 74.93,26.67 75.56,26.04 76.2,26.04 76.45,26.29 77.09,26.29 77.29,26.09 U11.19
JOE3  (via drill 0.35)
  Top 0.152: U8.52 64.31,30.94 68.96,26.29 73.94,26.29 v74.17,26.06 | v89.03,26.54 v89.04,26.53 U12.19
  Bottom 0.203: v74.17,26.06 75.08,25.15 82.3,25.15 83.69,26.54 v89.03,26.54
JTAGEN  (via drill 0.35)
  Top 0.203: RN17.3 44.18,44.47 v44.7,43.94 | v46.23,45.09 46.61,45.47 51.05,45.47 51.69,44.83 U8.15
  Bottom 0.203: v46.23,45.09 45.09,43.94 v44.7,43.94 44.7,42.93 42.93,41.15 JTAG.8
LED_DRIVE  (via drill 0.35)
  Top 0.152: LED1.C 53.72,69.39